# EAGLE design COZIR-LP-Breakout (EAGLE 8.2.0)
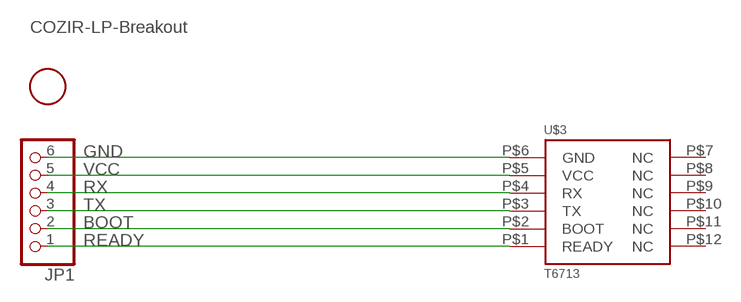
[diagram p0: schematic, sheet 1]

## Parts
JP1  PINHD-1X6  [1X06]
U$2  FIDUCIAL  [FIDUCIAL_1MM]
U$3  T6713  [RECEPTACLE_1.27MM_2X6]

## Nets
BOOT: JP1.2 U$3.P$2(BOOT)
GND: JP1.6 U$3.P$6(GND)
READY: JP1.1 U$3.P$1(READY)
RX: JP1.4 U$3.P$4(RX)
TX: JP1.3 U$3.P$3(TX)
VCC: JP1.5 U$3.P$5(VCC)
Unconnected: U$3.P$7(NC) U$3.P$8(NC) U$3.P$9(NC) U$3.P$10(NC) U$3.P$11(NC) U$3.P$12(NC)

## Notes on the sheet
- COZIR-LP-Breakout

## Library data of the parts
JP1 = adafruit:PINHD-1X6: PIN HEADER
U$2 = adafruit:FIDUCIAL: For use by pick and place machines to calibrate the vision/machine, 1mm By microbuilder.eu
U$3 = Amphenol:T6713: 2x6 header 1.27mm pitch This is a library for Amphenol FCI 2x6 header with 1.27mm pitch used on COZIR-LP CO2 sensor. The sensor actually uses 1x6 1.27mm header, so the second row is left unconnected. MPN: 20021311-00012T4LF Datasheet: http://portal.fciconnect.com/Comergent//fci/drawing/20021311.pdf Designed by Akram Ali https://github.com/AKstudios

## Board
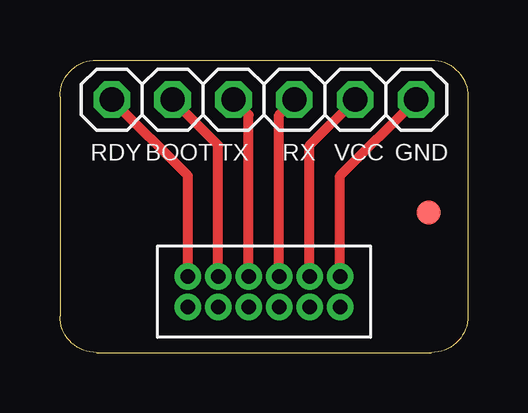
[diagram p1: board, top side]

Size 17.02 x 12.19 mm. Coordinates in mm from the lower left corner, seen from the top.
Outline: 0,10.67 0,1.52 arc90 1.52,0 15.49,0 arc90 17.02,1.52 17.02,10.67 arc90 15.49,12.19 1.52,12.19 arc90 0,10.67
Copper layers (1*16): Top 0.035mm / dielectric 1.5mm / Bottom 0.035mm
Design rules "default": minimum track width 10mil, minimum drill 24mil, track to track 8mil, track to pad 8mil, pad to pad 8mil, via to via 8mil, smd to smd 8mil, copper to edge 40mil, drill to drill 8mil, minimum pad ring 10mil, minimum via ring 8mil, stop-mask expansion 4mil, vias tented up to drill 0mil, thermal gap 10mil

### Footprints (pad centres in the part's own frame; a part is rotated, then mirrored left to right if it is on the bottom)
1X06 = drill 1.016 octagon: 1 -6.35,0; 2 -3.81,0; 3 -1.27,0; 4 1.27,0; 5 3.81,0; 6 6.35,0
FIDUCIAL_1MM = smd 1 x 1: 1 0,0
RECEPTACLE_1.27MM_2X6 = drill 0.6 pad 1.016: P$1 1.27,1.27; P$2 1.27,2.54; P$3 1.27,3.81; P$4 1.27,5.08; P$5 1.27,6.35; P$6 1.27,7.62; P$7 2.54,7.62; P$8 2.54,6.35; P$9 2.54,5.08; P$10 2.54,3.81; P$11 2.54,2.54; P$12 2.54,1.27

### Placement (x,y rotation side)
JP1  8.51,10.54 0 top
U$2  15.37,5.84 0 top
U$3  4.06,4.45 270 top

### Tracks (layer width: path | path; a pad name or v marks a point on that pad's centre or on a via)
BOOT
  Top 0.406: U$3.P$2 6.6,8.64 JP1.2
GND
  Top 0.406: U$3.P$6 11.68,7.37 JP1.6
READY
  Top 0.406: U$3.P$1 5.33,7.37 JP1.1
RX
  Top 0.406: U$3.P$4 9.14,9.91 JP1.4
TX
  Top 0.406: U$3.P$3 7.87,9.91 JP1.3
VCC
  Top 0.406: U$3.P$5 10.41,8.64 JP1.5

### Text on the board
_tsilk: RDY | BOOT | TX | RX | VCC | GND
_bsilk: COZIR-LP Breakout | Designed by | Akram Ali